# EAGLE design katzenlaserturret (EAGLE 9.5.1)
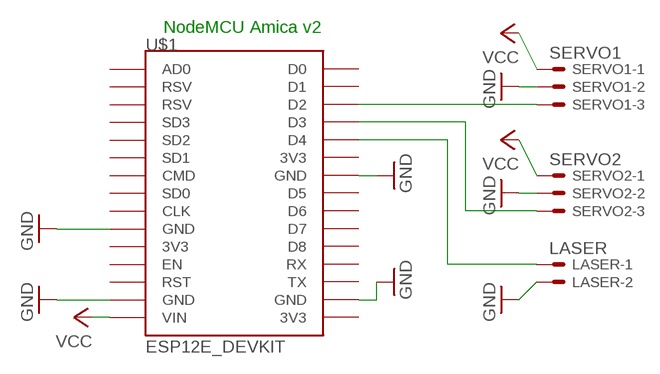
[diagram p0: schematic, sheet 1]

## Parts
LASER  LASER  22-23-2021  [22-23-2021]
SERVO1  SERVO1  22-23-2031  [22-23-2031]
SERVO2  SERVO2  22-23-2031  [22-23-2031]
U$1  ESP12E_DEVKIT  [ESP12E_DEVKIT]

## Nets
GND: LASER.2 SERVO1.2 SERVO2.2 U$1.GND@0(GND) U$1.GND@1(GND) U$1.GND@2(GND) U$1.GND@3(GND)
N$1: SERVO1.3 U$1.D2
N$2: SERVO2.3 U$1.D3
N$3: LASER.1 U$1.D4
VCC: SERVO1.1 SERVO2.1 U$1.VIN
Unconnected: U$1.3V3@0(3V3) U$1.3V3@1(3V3) U$1.3V3@2(3V3) U$1.AD0 U$1.CLK U$1.CMD U$1.D0 U$1.D1 U$1.D5 U$1.D6 U$1.D7 U$1.D8 U$1.EN U$1.RST U$1.RSV@0(RSV) U$1.RSV@1(RSV) U$1.RX U$1.SD0 U$1.SD1 U$1.SD2 U$1.SD3 U$1.TX

## Notes on the sheet
- NodeMCU Amica v2

## Library data of the parts
LASER = con-molex:22-23-2021: .100" (2.54mm) Center Header - 2 Pin; MF: MOLEX; MPN: 22-23-2021; OC_FARNELL: 1462926; OC_NEWARK: 25C3832
SERVO1 SERVO2 = con-molex:22-23-2031: .100" (2.54mm) Center Header - 3 Pin; MF: MOLEX; MPN: 22-23-2031; OC_FARNELL: 1462950; OC_NEWARK: 30C0862
U$1 = ESP12E_DEVKIT:ESP12E_DEVKIT: ESP12E DEVKIT BOARD

## Board
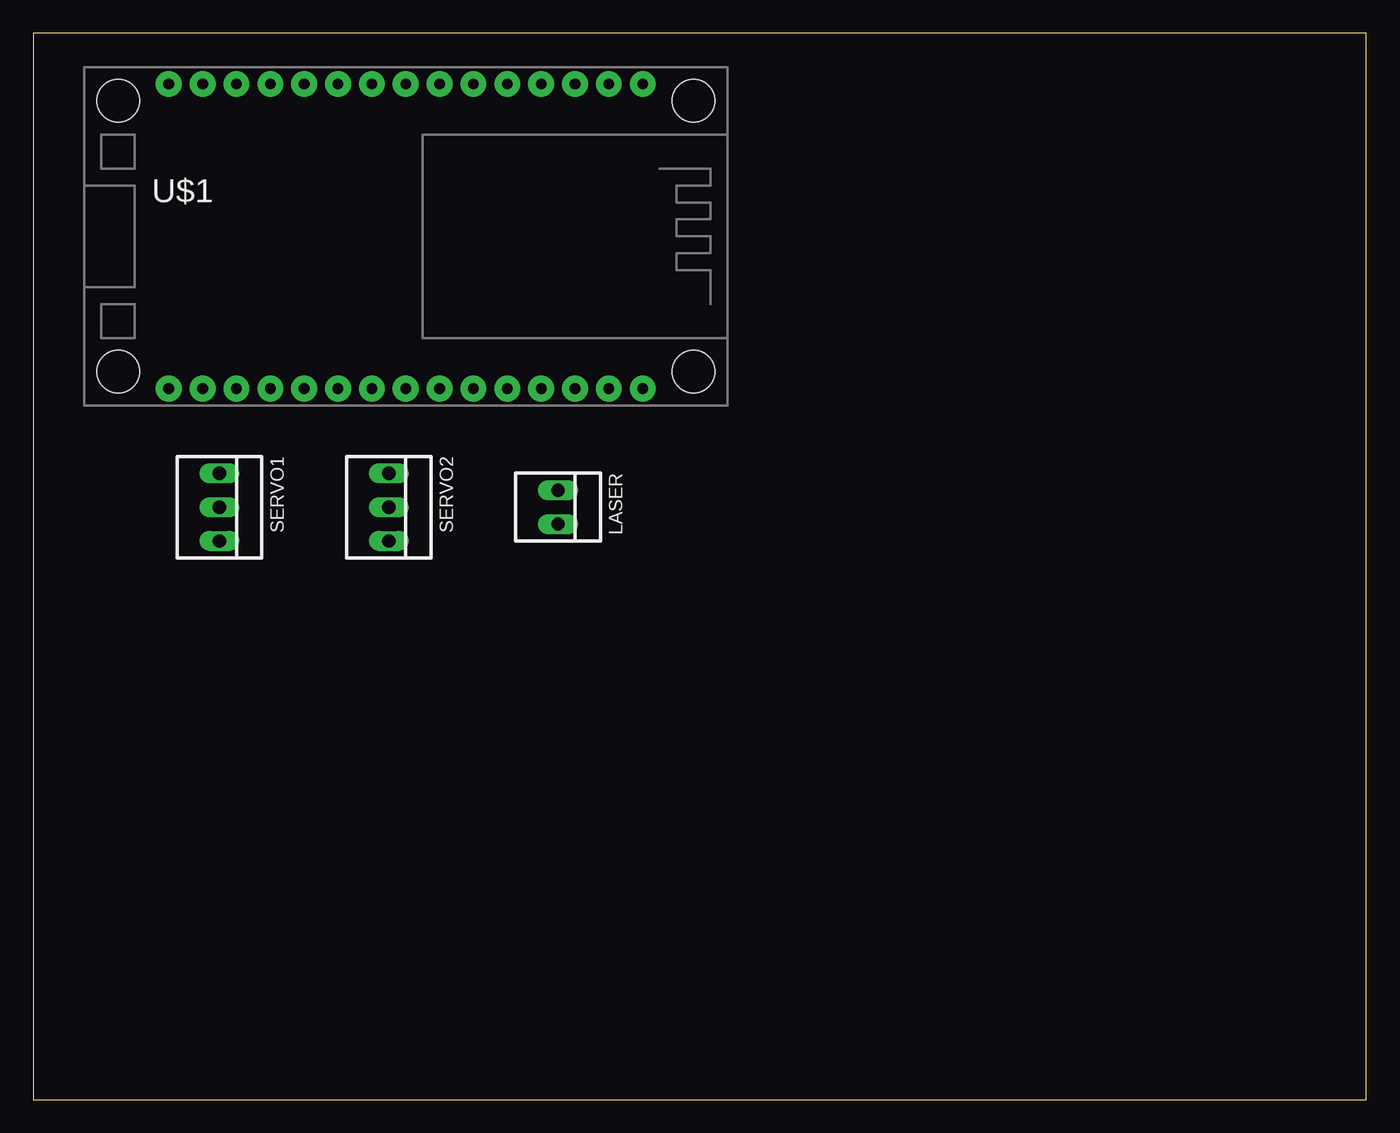
[diagram p1: board, top side]
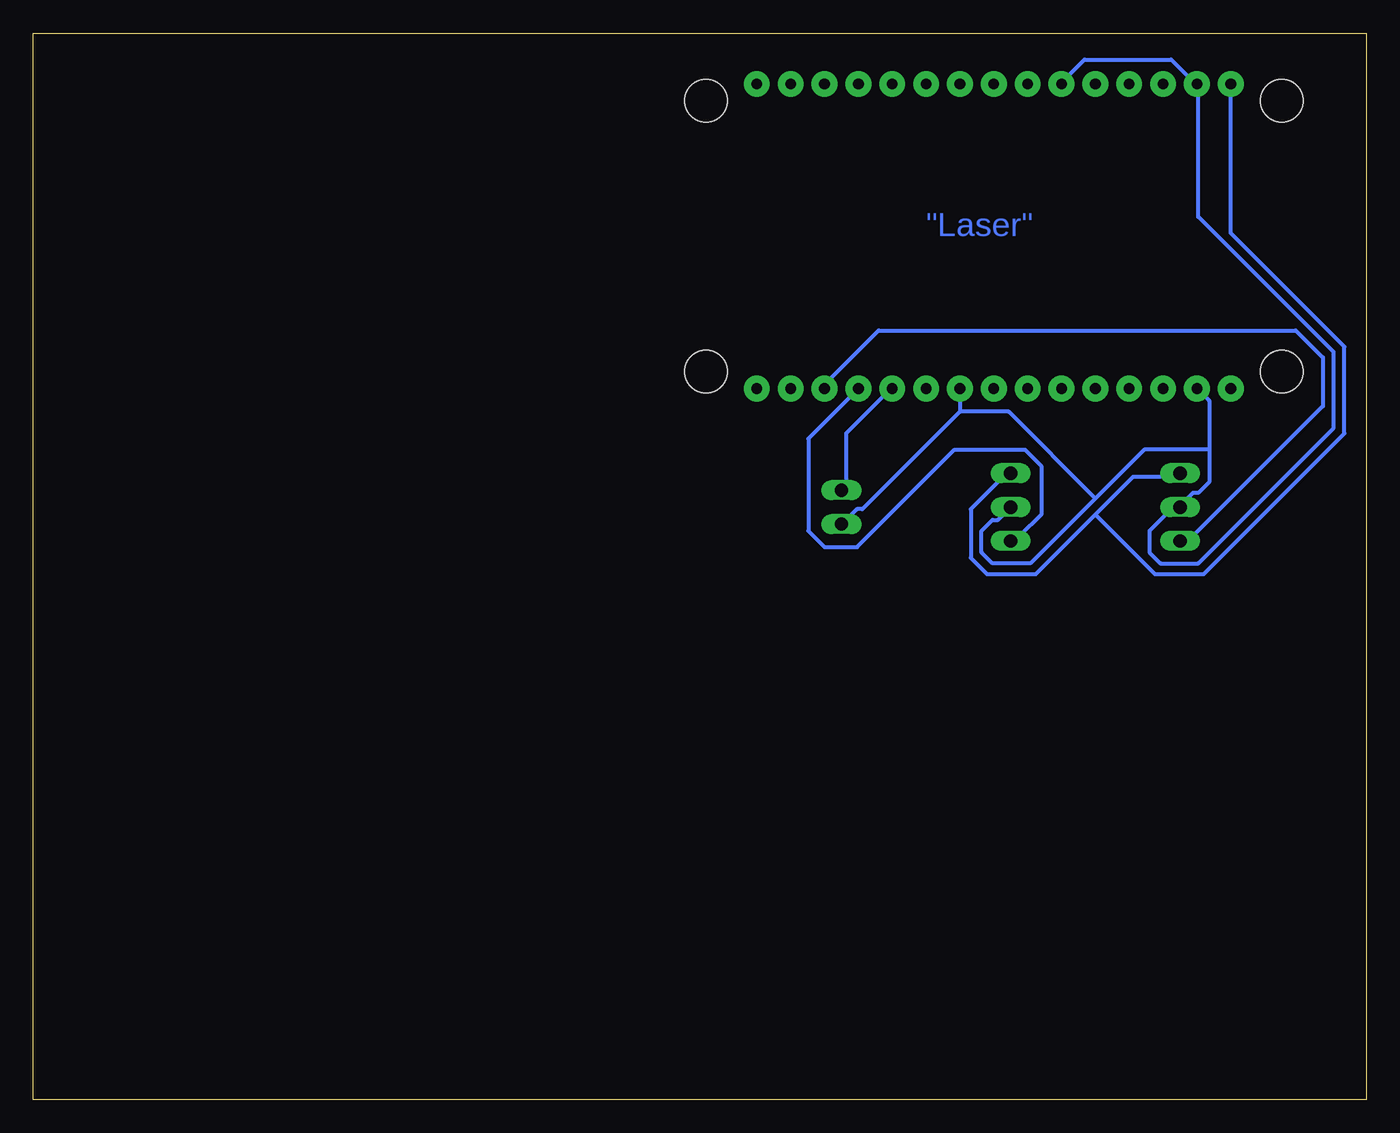
[diagram p2: board, bottom side, seen from below]

Size 100 x 80 mm. Coordinates in mm from the lower left corner, seen from the top.
Outline: 0,0 100,0 100,80 0,80 0,0
Copper layers (1*16): Top 0.035mm / dielectric 1.5mm / Bottom 0.035mm
Design rules "default *": minimum track width 12mil, minimum drill 0.35mm, track to track 20mil, track to pad 20mil, pad to pad 20mil, via to via 12mil, smd to smd 6mil, copper to edge 40mil, drill to drill 12mil, minimum pad ring 10mil, minimum via ring 8mil, stop-mask expansion 4mil, vias tented up to drill 0mil, thermal gap 10mil

### Footprints (pad centres in the part's own frame; a part is rotated, then mirrored left to right if it is on the bottom)
22-23-2021 = drill 1 long: 1 -1.27,0; 2 1.27,0
22-23-2031 = drill 1 long: 1 -2.54,0; 2 0,0; 3 2.54,0
ESP12E_DEVKIT = drill 0.8 pad 1.93: 3V3@0 -11.43,-7.62; 3V3@1 11.43,5.08; 3V3@2 11.43,-17.78; AD0 -11.43,17.78; CLK -11.43,-2.54; CMD -11.43,2.54; D0 11.43,17.78; D1 11.43,15.24; D2 11.43,12.7; D3 11.43,10.16; D4 11.43,7.62; D5 11.43,0; D6 11.43,-2.54; D7 11.43,-5.08; D8 11.43,-7.62; EN -11.43,-10.16; GND@0 -11.43,-5.08; GND@1 -11.43,-15.24; GND@2 11.43,2.54; GND@3 11.43,-15.24; RST -11.43,-12.7; RSV@0 -11.43,15.24; RSV@1 -11.43,12.7; RX 11.43,-10.16; SD0 -11.43,0; SD1 -11.43,5.08; SD2 -11.43,7.62; SD3 -11.43,10.16; TX 11.43,-12.7; VIN -11.43,-17.78 | hole 3.2: -10.16,21.59; 10.16,21.59; 10.16,-21.59; -10.16,-21.59

### Placement (x,y rotation side)
LASER  39.37,44.45 270 top
SERVO1  13.97,44.45 270 top
SERVO2  26.67,44.45 270 top
U$1  27.94,64.77 270 top

### Tracks (layer width: path | path; a pad name or v marks a point on that pad's centre or on a via)
GND
  Bottom 0.305: 30.48,51.61 37.8,44.3 38.2,44.3 39.01,43.48 LASER.2 | U$1.GND@2 30.48,51.61 | U$1.GND@0 22.76,76.4 21.13,78.03 14.63,78.03 13.01,76.4 U$1.GND@1 12.6,76 12.6,66.24 2.44,56.08 2.44,50.39 12.6,40.23 15.44,40.23 16.26,41.05 16.26,42.67 14.22,44.7 SERVO1.2 13.82,44.7 13.01,45.52 12.6,45.52 11.79,46.33 11.79,48.77 | 11.79,48.77 11.79,52.43 U$1.GND@3 | SERVO2.2 27.64,43.48 28.04,43.48 28.85,42.67 28.85,41.05 28.04,40.23 25.2,40.23 20.32,45.11 | 20.32,45.11 16.66,48.77 11.79,48.77 | 30.48,51.61 26.82,51.61 20.32,45.11
N$1
  Bottom 0.305: SERVO1.3 13.82,42.27 13.01,42.27 3.25,52.02 3.25,55.68 5.28,57.71 36.58,57.71 40.64,53.65 U$1.D2
N$2
  Bottom 0.305: U$1.D3 41.86,49.58 41.86,42.67 40.64,41.45 38.2,41.45 30.89,48.77 25.6,48.77 24.38,47.55 24.38,43.89 26.01,42.27 26.42,42.27 SERVO2.3
N$3
  Bottom 0.305: LASER.1 39.01,45.92 39.01,49.99 35.76,53.24 U$1.D4
VCC
  Bottom 0.305: 20.32,43.89 24.79,39.42 28.45,39.42 29.67,40.64 29.67,44.3 26.82,47.14 SERVO2.1 | 20.32,43.89 17.48,46.74 14.22,46.74 SERVO1.1 | U$1.VIN 10.16,65.02 1.63,56.49 1.63,49.99 12.19,39.42 15.85,39.42 20.32,43.89

### Text on the board
Bottom: "Laser"